# Altium project RPL_POWER.PrjPcb (part 2 of 2)
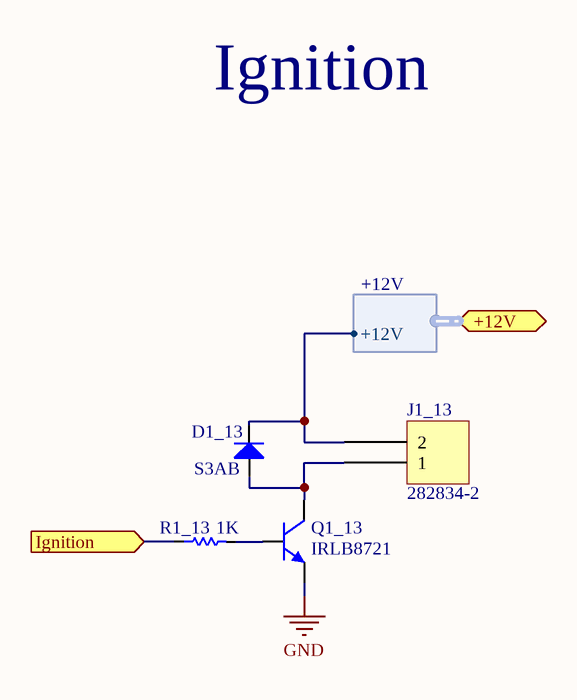
[diagram p14: RPL_IGNITION.SchDoc]

## Nets that join several sheets
+3V3: RPL_POWER_3V3 (6 pins), RPL_MCU (FB1_6.1 R3_6.1), CS_TEMP1 (C1_5_CS_TEMP1.2 C2_5_CS_TEMP1.2 MA_5_CS_TEMP1.19 MA_5_CS_TEMP1.20), CS_TEMP2 (C1_5_CS_TEMP2.2 C2_5_CS_TEMP2.2 MA_5_CS_TEMP2.19 MA_5_CS_TEMP2.20), CS_TEMP3 (C1_5_CS_TEMP3.2 C2_5_CS_TEMP3.2 MA_5_CS_TEMP3.19 MA_5_CS_TEMP3.20), CS_TEMP4 (C1_5_CS_TEMP4.2 C2_5_CS_TEMP4.2 MA_5_CS_TEMP4.19 MA_5_CS_TEMP4.20), CS_TEMP5 (C1_5_CS_TEMP5.2 C2_5_CS_TEMP5.2 MA_5_CS_TEMP5.19 MA_5_CS_TEMP5.20), CS_TEMP6 (C1_5_CS_TEMP6.2 C2_5_CS_TEMP6.2 MA_5_CS_TEMP6.19 MA_5_CS_TEMP6.20), CS_TEMP7 (C1_5_CS_TEMP7.2 C2_5_CS_TEMP7.2 MA_5_CS_TEMP7.19 MA_5_CS_TEMP7.20), CS_TEMP8 (C1_5_CS_TEMP8.2 C2_5_CS_TEMP8.2 MA_5_CS_TEMP8.19 MA_5_CS_TEMP8.20), RPL_IMU (22 pins), RPL_CAN (9 pins), RPL_MCU_E (5 pins)
+5V: RPL_POWER_5V (7 pins), U_RPL_POWER_SOLENOIDS_REV21 (R1_9_U_RPL_POWER_SOLENOIDS_REV21.2), U_RPL_POWER_SOLENOIDS_REV22 (R1_9_U_RPL_POWER_SOLENOIDS_REV22.2), U_RPL_POWER_SOLENOIDS_REV23 (R1_9_U_RPL_POWER_SOLENOIDS_REV23.2), U_RPL_POWER_SOLENOIDS_REV24 (R1_9_U_RPL_POWER_SOLENOIDS_REV24.2), U_RPL_POWER_SOLENOIDS_REV25 (R1_9_U_RPL_POWER_SOLENOIDS_REV25.2), U_RPL_POWER_SOLENOIDS_REV26 (R1_9_U_RPL_POWER_SOLENOIDS_REV26.2), U_RPL_POWER_SOLENOIDS_REV27 (R1_9_U_RPL_POWER_SOLENOIDS_REV27.2), U_RPL_POWER_SOLENOIDS_REV28 (R1_9_U_RPL_POWER_SOLENOIDS_REV28.2), U_RPL_POWER_SOLENOIDS_REV29 (R1_9_U_RPL_POWER_SOLENOIDS_REV29.2), U_RPL_POWER_SOLENOIDS_REV210 (R1_9_U_RPL_POWER_SOLENOIDS_REV210.2), U_RPL_POWER_SOLENOIDS_REV211 (R1_9_U_RPL_POWER_SOLENOIDS_REV211.2), U_RPL_POWER_SOLENOIDS_REV212 (R1_9_U_RPL_POWER_SOLENOIDS_REV212.2), U_RPL_POWER_SOLENOIDS_REV213 (R1_9_U_RPL_POWER_SOLENOIDS_REV213.2), U_RPL_POWER_SOLENOIDS_REV214 (R1_9_U_RPL_POWER_SOLENOIDS_REV214.2), U_RPL_POWER_SOLENOIDS_REV215 (R1_9_U_RPL_POWER_SOLENOIDS_REV215.2), U_RPL_POWER_SOLENOIDS_REV216 (R1_9_U_RPL_POWER_SOLENOIDS_REV216.2), RPL_MCU_E (P2_10.2)
+24V: RPL_POWER_24V_REV3 (R9_1.2 R11_1.2 U1_1.26), U_RPL_POWER_SOLENOIDS_REV21 (C1_9_U_RPL_POWER_SOLENOIDS_REV21.1 RS_9_U_RPL_POWER_SOLENOIDS_REV21.2 U5_9_U_RPL_POWER_SOLENOIDS_REV21.8), U_RPL_POWER_SOLENOIDS_REV22 (C1_9_U_RPL_POWER_SOLENOIDS_REV22.1 RS_9_U_RPL_POWER_SOLENOIDS_REV22.2 U5_9_U_RPL_POWER_SOLENOIDS_REV22.8), U_RPL_POWER_SOLENOIDS_REV23 (C1_9_U_RPL_POWER_SOLENOIDS_REV23.1 RS_9_U_RPL_POWER_SOLENOIDS_REV23.2 U5_9_U_RPL_POWER_SOLENOIDS_REV23.8), U_RPL_POWER_SOLENOIDS_REV24 (C1_9_U_RPL_POWER_SOLENOIDS_REV24.1 RS_9_U_RPL_POWER_SOLENOIDS_REV24.2 U5_9_U_RPL_POWER_SOLENOIDS_REV24.8), U_RPL_POWER_SOLENOIDS_REV25 (C1_9_U_RPL_POWER_SOLENOIDS_REV25.1 RS_9_U_RPL_POWER_SOLENOIDS_REV25.2 U5_9_U_RPL_POWER_SOLENOIDS_REV25.8), U_RPL_POWER_SOLENOIDS_REV26 (C1_9_U_RPL_POWER_SOLENOIDS_REV26.1 RS_9_U_RPL_POWER_SOLENOIDS_REV26.2 U5_9_U_RPL_POWER_SOLENOIDS_REV26.8), U_RPL_POWER_SOLENOIDS_REV27 (C1_9_U_RPL_POWER_SOLENOIDS_REV27.1 RS_9_U_RPL_POWER_SOLENOIDS_REV27.2 U5_9_U_RPL_POWER_SOLENOIDS_REV27.8), U_RPL_POWER_SOLENOIDS_REV28 (C1_9_U_RPL_POWER_SOLENOIDS_REV28.1 RS_9_U_RPL_POWER_SOLENOIDS_REV28.2 U5_9_U_RPL_POWER_SOLENOIDS_REV28.8), U_RPL_POWER_SOLENOIDS_REV29 (C1_9_U_RPL_POWER_SOLENOIDS_REV29.1 RS_9_U_RPL_POWER_SOLENOIDS_REV29.2 U5_9_U_RPL_POWER_SOLENOIDS_REV29.8), U_RPL_POWER_SOLENOIDS_REV210 (C1_9_U_RPL_POWER_SOLENOIDS_REV210.1 RS_9_U_RPL_POWER_SOLENOIDS_REV210.2 U5_9_U_RPL_POWER_SOLENOIDS_REV210.8), U_RPL_POWER_SOLENOIDS_REV211 (C1_9_U_RPL_POWER_SOLENOIDS_REV211.1 RS_9_U_RPL_POWER_SOLENOIDS_REV211.2 U5_9_U_RPL_POWER_SOLENOIDS_REV211.8), U_RPL_POWER_SOLENOIDS_REV212 (C1_9_U_RPL_POWER_SOLENOIDS_REV212.1 RS_9_U_RPL_POWER_SOLENOIDS_REV212.2 U5_9_U_RPL_POWER_SOLENOIDS_REV212.8), U_RPL_POWER_SOLENOIDS_REV213 (C1_9_U_RPL_POWER_SOLENOIDS_REV213.1 RS_9_U_RPL_POWER_SOLENOIDS_REV213.2 U5_9_U_RPL_POWER_SOLENOIDS_REV213.8), U_RPL_POWER_SOLENOIDS_REV214 (C1_9_U_RPL_POWER_SOLENOIDS_REV214.1 RS_9_U_RPL_POWER_SOLENOIDS_REV214.2 U5_9_U_RPL_POWER_SOLENOIDS_REV214.8), U_RPL_POWER_SOLENOIDS_REV215 (C1_9_U_RPL_POWER_SOLENOIDS_REV215.1 RS_9_U_RPL_POWER_SOLENOIDS_REV215.2 U5_9_U_RPL_POWER_SOLENOIDS_REV215.8), U_RPL_POWER_SOLENOIDS_REV216 (C1_9_U_RPL_POWER_SOLENOIDS_REV216.1 RS_9_U_RPL_POWER_SOLENOIDS_REV216.2 U5_9_U_RPL_POWER_SOLENOIDS_REV216.8)
+42VDC: RPL_POWER_24V_REV3 (6 pins), RPL_POWER_3V3 (5 pins), RPL_POWER_5V (5 pins), RPL_POWER_12V (5 pins), RPL_POWER_BATTERY (P1.1)
GND: RPL_POWER_24V_REV3 (21 pins), RPL_POWER_3V3 (20 pins), RPL_POWER_5V (14 pins), RPL_POWER_12V (14 pins), RPL_MCU (18 pins), U_RPL_POWER_SOLENOIDS_REV21 (5 pins), U_RPL_POWER_SOLENOIDS_REV22 (5 pins), U_RPL_POWER_SOLENOIDS_REV23 (5 pins), U_RPL_POWER_SOLENOIDS_REV24 (5 pins), U_RPL_POWER_SOLENOIDS_REV25 (5 pins), U_RPL_POWER_SOLENOIDS_REV26 (5 pins), U_RPL_POWER_SOLENOIDS_REV27 (5 pins), U_RPL_POWER_SOLENOIDS_REV28 (5 pins), U_RPL_POWER_SOLENOIDS_REV29 (5 pins), U_RPL_POWER_SOLENOIDS_REV210 (5 pins), U_RPL_POWER_SOLENOIDS_REV211 (5 pins), U_RPL_POWER_SOLENOIDS_REV212 (5 pins), U_RPL_POWER_SOLENOIDS_REV213 (5 pins), U_RPL_POWER_SOLENOIDS_REV214 (5 pins), U_RPL_POWER_SOLENOIDS_REV215 (5 pins), U_RPL_POWER_SOLENOIDS_REV216 (5 pins), CS_TEMP1 (5 pins), CS_TEMP2 (5 pins), CS_TEMP3 (5 pins), CS_TEMP4 (5 pins), CS_TEMP5 (5 pins), CS_TEMP6 (5 pins), CS_TEMP7 (5 pins), CS_TEMP8 (5 pins), RPL_IMU (28 pins), RPL_CAN (10 pins), RPL_MCU_E (14 pins), RPL_POWER_BATTERY (P2.1), RPL_RIO (J2.1), RPL_IGNITION (Q1_13.1)
CS_TEMP1: RPL_MCU (U1_6.88), CS_TEMP1 (MA_5_CS_TEMP1.13)
CS_TEMP2: RPL_MCU (U1_6.89), CS_TEMP2 (MA_5_CS_TEMP2.13)
CS_TEMP3: RPL_MCU (U1_6.90), CS_TEMP3 (MA_5_CS_TEMP3.13)
CS_TEMP4: RPL_MCU (U1_6.91), CS_TEMP4 (MA_5_CS_TEMP4.13)
CS_TEMP5: RPL_MCU (U1_6.26), CS_TEMP5 (MA_5_CS_TEMP5.13)
CS_TEMP6: RPL_MCU (U1_6.27), CS_TEMP6 (MA_5_CS_TEMP6.13)
CS_TEMP7: RPL_MCU (U1_6.28), CS_TEMP7 (MA_5_CS_TEMP7.13)
CS_TEMP8: RPL_MCU (U1_6.29), CS_TEMP8 (MA_5_CS_TEMP8.13)
~{FAULT}1: RPL_MCU (U1_6.54), U_RPL_POWER_SOLENOIDS_REV21 (R1_9_U_RPL_POWER_SOLENOIDS_REV21.1 U5_9_U_RPL_POWER_SOLENOIDS_REV21.3)
~{FAULT}2: RPL_MCU (U1_6.55), U_RPL_POWER_SOLENOIDS_REV22 (R1_9_U_RPL_POWER_SOLENOIDS_REV22.1 U5_9_U_RPL_POWER_SOLENOIDS_REV22.3)
~{FAULT}3: RPL_MCU (U1_6.76), U_RPL_POWER_SOLENOIDS_REV23 (R1_9_U_RPL_POWER_SOLENOIDS_REV23.1 U5_9_U_RPL_POWER_SOLENOIDS_REV23.3)
~{FAULT}4: RPL_MCU (U1_6.77), U_RPL_POWER_SOLENOIDS_REV24 (R1_9_U_RPL_POWER_SOLENOIDS_REV24.1 U5_9_U_RPL_POWER_SOLENOIDS_REV24.3)
~{FAULT}5: RPL_MCU (U1_6.78), U_RPL_POWER_SOLENOIDS_REV25 (R1_9_U_RPL_POWER_SOLENOIDS_REV25.1 U5_9_U_RPL_POWER_SOLENOIDS_REV25.3)
~{FAULT}6: RPL_MCU (U1_6.79), U_RPL_POWER_SOLENOIDS_REV26 (R1_9_U_RPL_POWER_SOLENOIDS_REV26.1 U5_9_U_RPL_POWER_SOLENOIDS_REV26.3)
~{FAULT}7: RPL_MCU (U1_6.80), U_RPL_POWER_SOLENOIDS_REV27 (R1_9_U_RPL_POWER_SOLENOIDS_REV27.1 U5_9_U_RPL_POWER_SOLENOIDS_REV27.3)
~{FAULT}8: RPL_MCU (U1_6.81), U_RPL_POWER_SOLENOIDS_REV28 (R1_9_U_RPL_POWER_SOLENOIDS_REV28.1 U5_9_U_RPL_POWER_SOLENOIDS_REV28.3)
~{FAULT}9: RPL_MCU (U1_6.30), U_RPL_POWER_SOLENOIDS_REV29 (R1_9_U_RPL_POWER_SOLENOIDS_REV29.1 U5_9_U_RPL_POWER_SOLENOIDS_REV29.3)
~{FAULT}10: RPL_MCU (U1_6.31), U_RPL_POWER_SOLENOIDS_REV210 (R1_9_U_RPL_POWER_SOLENOIDS_REV210.1 U5_9_U_RPL_POWER_SOLENOIDS_REV210.3)
~{FAULT}11: RPL_MCU (U1_6.46), U_RPL_POWER_SOLENOIDS_REV211 (R1_9_U_RPL_POWER_SOLENOIDS_REV211.1 U5_9_U_RPL_POWER_SOLENOIDS_REV211.3)
~{FAULT}12: RPL_MCU (U1_6.47), U_RPL_POWER_SOLENOIDS_REV212 (R1_9_U_RPL_POWER_SOLENOIDS_REV212.1 U5_9_U_RPL_POWER_SOLENOIDS_REV212.3)
~{FAULT}13: RPL_MCU (U1_6.48), U_RPL_POWER_SOLENOIDS_REV213 (R1_9_U_RPL_POWER_SOLENOIDS_REV213.1 U5_9_U_RPL_POWER_SOLENOIDS_REV213.3)
~{FAULT}14: RPL_MCU (U1_6.49), U_RPL_POWER_SOLENOIDS_REV214 (R1_9_U_RPL_POWER_SOLENOIDS_REV214.1 U5_9_U_RPL_POWER_SOLENOIDS_REV214.3)
~{FAULT}15: RPL_MCU (U1_6.50), U_RPL_POWER_SOLENOIDS_REV215 (R1_9_U_RPL_POWER_SOLENOIDS_REV215.1 U5_9_U_RPL_POWER_SOLENOIDS_REV215.3)
~{FAULT}16: RPL_MCU (U1_6.51), U_RPL_POWER_SOLENOIDS_REV216 (R1_9_U_RPL_POWER_SOLENOIDS_REV216.1 U5_9_U_RPL_POWER_SOLENOIDS_REV216.3)
NetC4_2_1: RPL_POWER_12V (7 pins), RPL_RIO (J2.2), RPL_IGNITION (D1_13.K J1_13.2)
NetJ1_1: RPL_CAN (R3_8.1 U2_8.7), RPL_RIO (J1.1)
NetJ1_2: RPL_CAN (R3_8.2 U2_8.6), RPL_RIO (J1.2)
NetJ1_10_3: RPL_MCU (U1_6.25), RPL_MCU_E (J1_10.3)
NetJ1_10_4: RPL_MCU (U1_6.9), CS_TEMP1 (MA_5_CS_TEMP1.12), CS_TEMP2 (MA_5_CS_TEMP2.12), CS_TEMP3 (MA_5_CS_TEMP3.12), CS_TEMP4 (MA_5_CS_TEMP4.12), CS_TEMP5 (MA_5_CS_TEMP5.12), CS_TEMP6 (MA_5_CS_TEMP6.12), CS_TEMP7 (MA_5_CS_TEMP7.12), CS_TEMP8 (MA_5_CS_TEMP8.12), RPL_MCU_E (J1_10.4)
NetJ1_10_5: RPL_MCU (U1_6.10), CS_TEMP1 (MA_5_CS_TEMP1.11), CS_TEMP2 (MA_5_CS_TEMP2.11), CS_TEMP3 (MA_5_CS_TEMP3.11), CS_TEMP4 (MA_5_CS_TEMP4.11), CS_TEMP5 (MA_5_CS_TEMP5.11), CS_TEMP6 (MA_5_CS_TEMP6.11), CS_TEMP7 (MA_5_CS_TEMP7.11), CS_TEMP8 (MA_5_CS_TEMP8.11), RPL_MCU_E (J1_10.5)
NetJ1_10_6: RPL_MCU (U1_6.11), CS_TEMP1 (MA_5_CS_TEMP1.14), CS_TEMP2 (MA_5_CS_TEMP2.14), CS_TEMP3 (MA_5_CS_TEMP3.14), CS_TEMP4 (MA_5_CS_TEMP4.14), CS_TEMP5 (MA_5_CS_TEMP5.14), CS_TEMP6 (MA_5_CS_TEMP6.14), CS_TEMP7 (MA_5_CS_TEMP7.14), CS_TEMP8 (MA_5_CS_TEMP8.14), RPL_MCU_E (J1_10.6)
NetJ2_10_3: RPL_MCU (U1_6.6), RPL_MCU_E (J2_10.3)
NetJ2_10_4: RPL_MCU (U1_6.7), RPL_MCU_E (J2_10.4)
NetJ4_10_1: RPL_MCU (U1_6.52), RPL_MCU_E (J4_10.1)
NetJ4_10_2: RPL_MCU (U1_6.53), RPL_MCU_E (J4_10.2)
NetJ4_10_3: RPL_MCU (U1_6.74), RPL_MCU_E (J4_10.3)
NetJ4_10_4: RPL_MCU (U1_6.75), RPL_MCU_E (J4_10.4)
NetJ4_10_5: RPL_MCU (U1_6.96), RPL_MCU_E (J4_10.5)
NetJ4_10_6: RPL_MCU (U1_6.97), RPL_MCU_E (J4_10.6)
NetJ4_10_7: RPL_MCU (U1_6.98), RPL_MCU_E (J4_10.7)
NetJ4_10_8: RPL_MCU (U1_6.99), RPL_MCU_E (J4_10.8)
NetP1_10_2: RPL_MCU (U1_6.94), RPL_MCU_E (P1_10.2)
NetP1_10_4: RPL_MCU (U1_6.95), RPL_MCU_E (P1_10.4)
NetP1_10_6: RPL_MCU (U1_6.93), RPL_MCU_E (P1_10.6)
NetP1_10_8: RPL_MCU (U1_6.92), RPL_MCU_E (P1_10.8)
NetP2_10_1: RPL_MCU (U1_6.64), RPL_MCU_E (P2_10.1)
NetP2_10_3: RPL_MCU (U1_6.65), RPL_MCU_E (P2_10.3)
NetP2_10_5: RPL_MCU (U1_6.66), RPL_MCU_E (P2_10.5)
NetP2_10_7: RPL_MCU (U1_6.67), RPL_MCU_E (P2_10.7)
NetP2_10_9: RPL_MCU (U1_6.68), RPL_MCU_E (P2_10.9)
NetP2_10_11: RPL_MCU (U1_6.69), RPL_MCU_E (P2_10.11)
NetR1_13_1: RPL_MCU (U1_6.71), RPL_IGNITION (R1_13.1)
NetR2_10_1: RPL_MCU (U1_6.32), RPL_MCU_E (R2_10.1)
NetR3_10_1: RPL_MCU (U1_6.33), RPL_MCU_E (R3_10.1)
NetR4_10_1: RPL_MCU (U1_6.34), RPL_MCU_E (R4_10.1)
NetU1_6_35: RPL_MCU (U1_6.35), RPL_CAN (U1_8.12)
NetU1_6_36: RPL_MCU (U1_6.36), RPL_CAN (U1_8.16)
NetU1_6_37: RPL_MCU (U1_6.37), RPL_CAN (U1_8.13)
NetU1_6_38: RPL_MCU (U1_6.38), RPL_CAN (U1_8.14)
~{RST}: RPL_MCU (C11_6.1 R3_6.2 S1_6.1 U1_6.83), RPL_MCU_E (P1_10.10)
SCL: RPL_MCU (U1_6.3), RPL_IMU (BME1_7.4 BNO1_7.19 MPL_7.8 R3_7.2), RPL_MCU_E (J3_10.4)
SDA: RPL_MCU (U1_6.2), RPL_IMU (BME1_7.3 BNO1_7.20 MPL_7.7 R5_7.2), RPL_MCU_E (J3_10.3)
SOL1: RPL_MCU (U1_6.16), U_RPL_POWER_SOLENOIDS_REV21 (U5_9_U_RPL_POWER_SOLENOIDS_REV21.4)
SOL2: RPL_MCU (U1_6.17), U_RPL_POWER_SOLENOIDS_REV22 (U5_9_U_RPL_POWER_SOLENOIDS_REV22.4)
SOL3: RPL_MCU (U1_6.18), U_RPL_POWER_SOLENOIDS_REV23 (U5_9_U_RPL_POWER_SOLENOIDS_REV23.4)
SOL4: RPL_MCU (U1_6.19), U_RPL_POWER_SOLENOIDS_REV24 (U5_9_U_RPL_POWER_SOLENOIDS_REV24.4)
SOL5: RPL_MCU (U1_6.20), U_RPL_POWER_SOLENOIDS_REV25 (U5_9_U_RPL_POWER_SOLENOIDS_REV25.4)
SOL6: RPL_MCU (U1_6.21), U_RPL_POWER_SOLENOIDS_REV26 (U5_9_U_RPL_POWER_SOLENOIDS_REV26.4)
SOL7: RPL_MCU (U1_6.22), U_RPL_POWER_SOLENOIDS_REV27 (U5_9_U_RPL_POWER_SOLENOIDS_REV27.4)
SOL8: RPL_MCU (U1_6.23), U_RPL_POWER_SOLENOIDS_REV28 (U5_9_U_RPL_POWER_SOLENOIDS_REV28.4)
SOL9: RPL_MCU (U1_6.56), U_RPL_POWER_SOLENOIDS_REV29 (U5_9_U_RPL_POWER_SOLENOIDS_REV29.4)
SOL10: RPL_MCU (U1_6.57), U_RPL_POWER_SOLENOIDS_REV210 (U5_9_U_RPL_POWER_SOLENOIDS_REV210.4)
SOL11: RPL_MCU (U1_6.58), U_RPL_POWER_SOLENOIDS_REV211 (U5_9_U_RPL_POWER_SOLENOIDS_REV211.4)
SOL12: RPL_MCU (U1_6.59), U_RPL_POWER_SOLENOIDS_REV212 (U5_9_U_RPL_POWER_SOLENOIDS_REV212.4)
SOL13: RPL_MCU (U1_6.60), U_RPL_POWER_SOLENOIDS_REV213 (U5_9_U_RPL_POWER_SOLENOIDS_REV213.4)
SOL14: RPL_MCU (U1_6.61), U_RPL_POWER_SOLENOIDS_REV214 (U5_9_U_RPL_POWER_SOLENOIDS_REV214.4)
SOL15: RPL_MCU (U1_6.62), U_RPL_POWER_SOLENOIDS_REV215 (U5_9_U_RPL_POWER_SOLENOIDS_REV215.4)
SOL16: RPL_MCU (U1_6.63), U_RPL_POWER_SOLENOIDS_REV216 (U5_9_U_RPL_POWER_SOLENOIDS_REV216.4)